# Altium schematic sheet reefpi_pico_fet.SchDoc: reef-pi Pico FET output block
size A4; DocumentNumber: 8; SheetNumber: 8; SheetTotal: 8
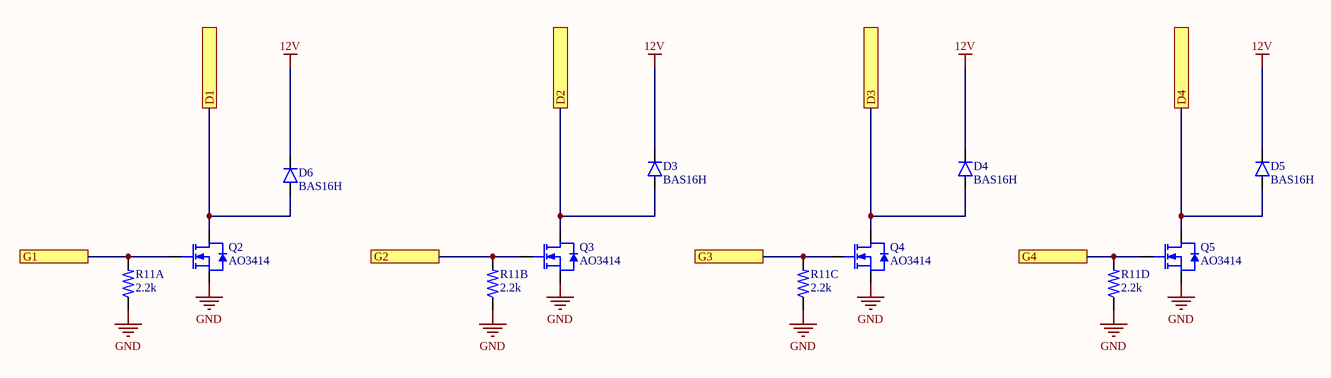
[diagram p0: reefpi_pico_fet.SchDoc]

## Parts
D3  BAS16H  [SOD323R_INFINEON]
D4  BAS16H  [SOD323R_INFINEON]
D5  BAS16H  [SOD323R_INFINEON]
D6  BAS16H  [SOD323R_INFINEON]
Q2  AO3414  [SOT23-3]
Q3  AO3414  [SOT23-3]
Q4  AO3414  [SOT23-3]
Q5  AO3414  [SOT23-3]
R11  2.2k  [R0603x4]  (parts A,B,C,D of 4)

## Ports
D1, D2, D3, D4, G1, G2, G3, G4

## Nets
12V: D3.K D4.K D5.K D6.K
GND: Q2.2(S) Q3.2(S) Q4.2(S) Q5.2(S) R11.1 R11.3 R11.5 R11.7
D1: D6.A Q2.3(D) ; port D1
D2: D3.A Q3.3(D) ; port D2
D3: D4.A Q4.3(D) ; port D3
D4: D5.A Q5.3(D) ; port D4
G1: Q2.1(G) R11.2 ; port G1
G2: Q3.1(G) R11.4 ; port G2
G3: Q4.1(G) R11.6 ; port G3
G4: Q5.1(G) R11.8 ; port G4

## Notes on the sheet
- Title
- Size:
- Date:
- A4
- Number:
- Time:
- Revision:
- Sheet
- of
- github.com/blueacro
- blueacro.com
- CERN OHL v1.2
- Made available under the
- File:
- © 2018 StackFoundry LLC. All Rights Reserved.

## Library data of the parts
D3-D6 = DIODE
Q2-Q5 = NFET
R11 = R-US-4ch